# Altium schematic sheet fuse.SchDoc
size A4; SheetNumber: 2; SheetTotal: 3
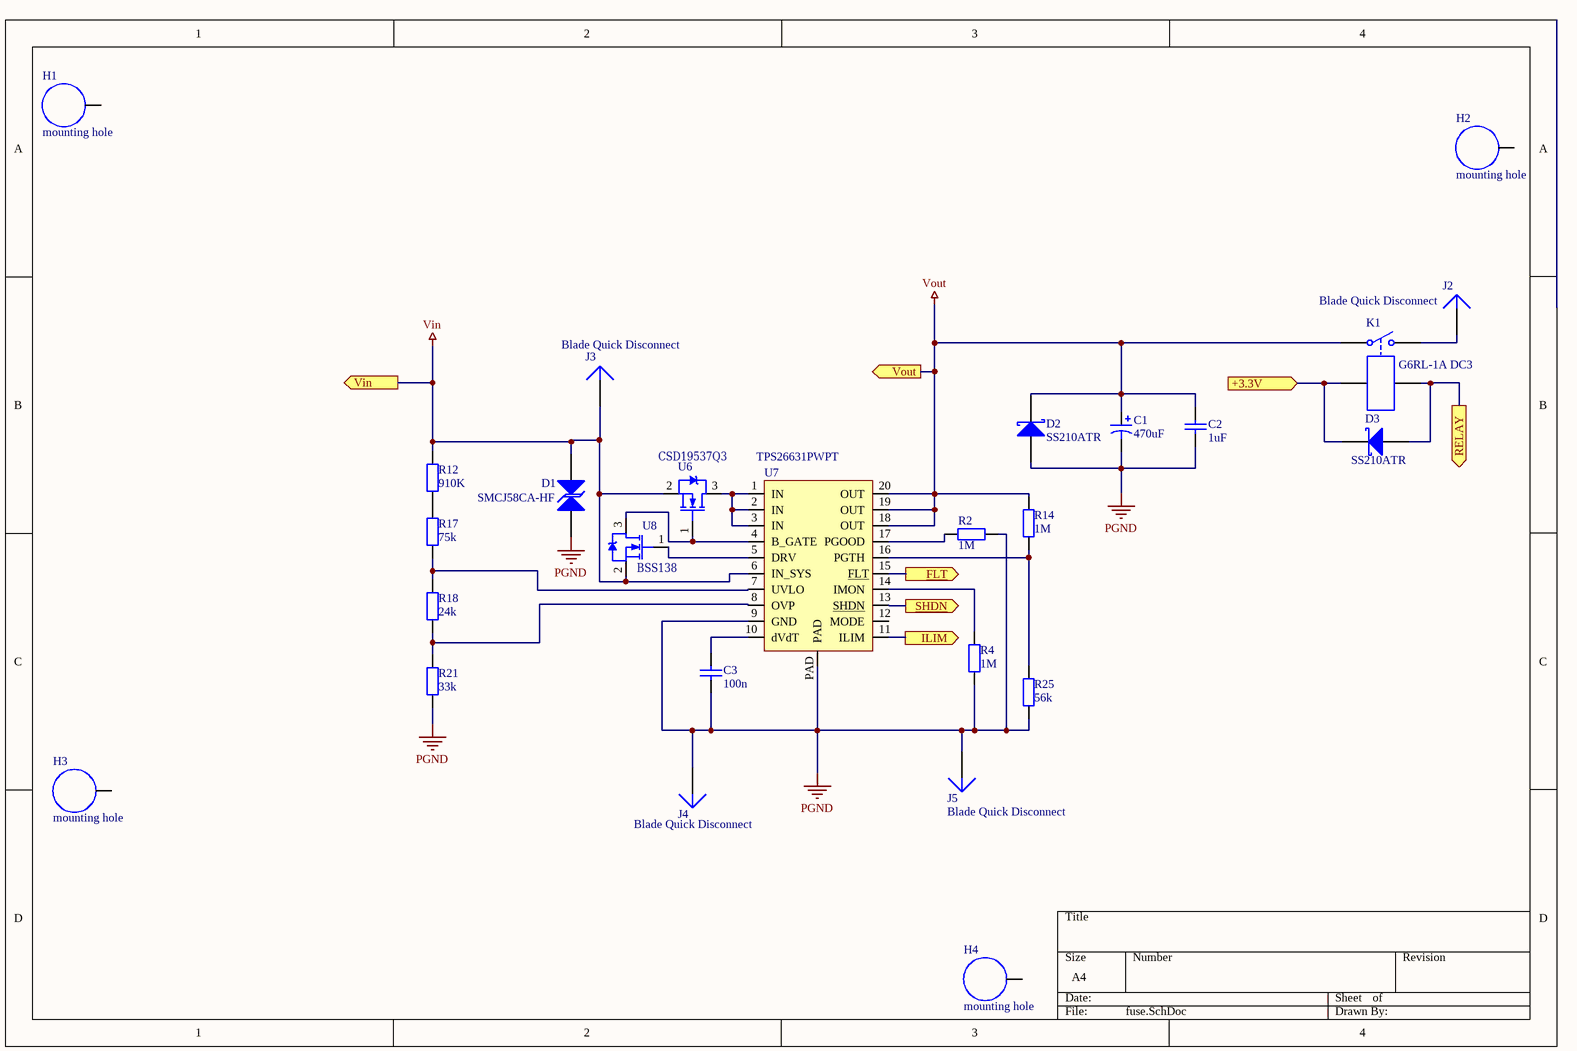
[diagram p0: fuse.SchDoc]

## Parts
C1  470uF  [CAP_16MM_SMD]
C2  1uF  [0805]
C3  100n  [0805]
D1  SMCJ58CA-HF  [DO-214AB-SMC Bipolar]
D2  SS210ATR  [DO-214AC, SMA]
D3  SS210ATR  [DO-214AC, SMA]
H1  mounting hole  [M3 HOLE iso]
H2  mounting hole  [M3 HOLE iso]
H3  mounting hole  [M3 HOLE iso]
H4  mounting hole  [M3 HOLE iso]
J2  Blade Quick Disconnect  [TE blade connector]
J3  Blade Quick Disconnect  [TE blade connector]
J4  Blade Quick Disconnect  [TE blade connector]
J5  Blade Quick Disconnect  [TE blade connector]
K1  G6RL-1A DC3  [G6RL-1A DC3 relay]
R2  1M  [0805]
R4  1M  [0805]
R12  910K  [0805]
R14  1M  [0805]
R17  75k  [0805]
R18  24k  [0805]
R21  33k  [0805]
R25  56k  [0805]
U6  ‎CSD19537Q3‎  [8-VSON (3,3x3,3)]
U7  TPS26631PWPT  [TSSOP_P065S6.6x6.6]
U8  BSS138‎  [SOT-23-3]

## Ports
+3.3V (in), FLT (out), ILIM (out), RELAY (out), SHDN (out), Vin (out), Vout (out)

## Nets
PGND: C1.2 C2.1 C3.2 D1.1(A) D2.2(A) J4.1 J5.1 R2.1 R4.2 R21.1 R25.1 U7.9(GND) U7.PAD
Vin: D1.2(K) J3.1 R12.2 U6.2(D) U7.6(IN_SYS) U8.2(D) ; port Vin
Vout: C1.1 C2.2 D2.1(K) K1.2 R14.2 U7.18(OUT) U7.19(OUT) U7.20(OUT) ; port Vout
+3.3V: D3.1(K) K1.1 ; port +3.3V
FLT: U7.15(FLT) ; port FLT
ILIM: U7.11(ILIM) ; port ILIM
RELAY: D3.2(A) K1.5 ; port RELAY
SHDN: U7.13(SHDN) ; port SHDN
NetC3_1: C3.1 U7.10(dVdT)
NetJ2_1: J2.1 K1.3
NetR2_2: R2.2 U7.17(PGOOD)
NetR4_1: R4.1 U7.14(IMON)
NetR12_1: R12.1 R17.2
NetR14_1: R14.1 R25.2 U7.16(PGTH)
NetR17_1: R17.1 R18.2 U7.7(UVLO)
NetR18_1: R18.1 R21.2 U7.8(OVP)
NetU6_1: U6.1(G) U7.4(B_GATE) U8.3(S)
NetU6_3: U6.3(S) U7.1(IN) U7.2(IN) U7.3(IN)
NetU7_5: U7.5(DRV) U8.1(G)

Not connected (* = marked no-connect by the designer): H1 1; H2 1; H3 1; H4 1; U7 12(MODE)

## Library data of the parts
C1 = cap pol
C2 C3 = cap
D1 = TVS Diode
D2 D3 = shotkey diode
K1 = Relay
R2 R4 R12 R14 R17 R18 R21 R25 = res0805
U6 U8 = N-mosfet en